# Altium schematic sheet greento_schematic.SchDoc
size A; SheetNumber: 1; SheetTotal: 1
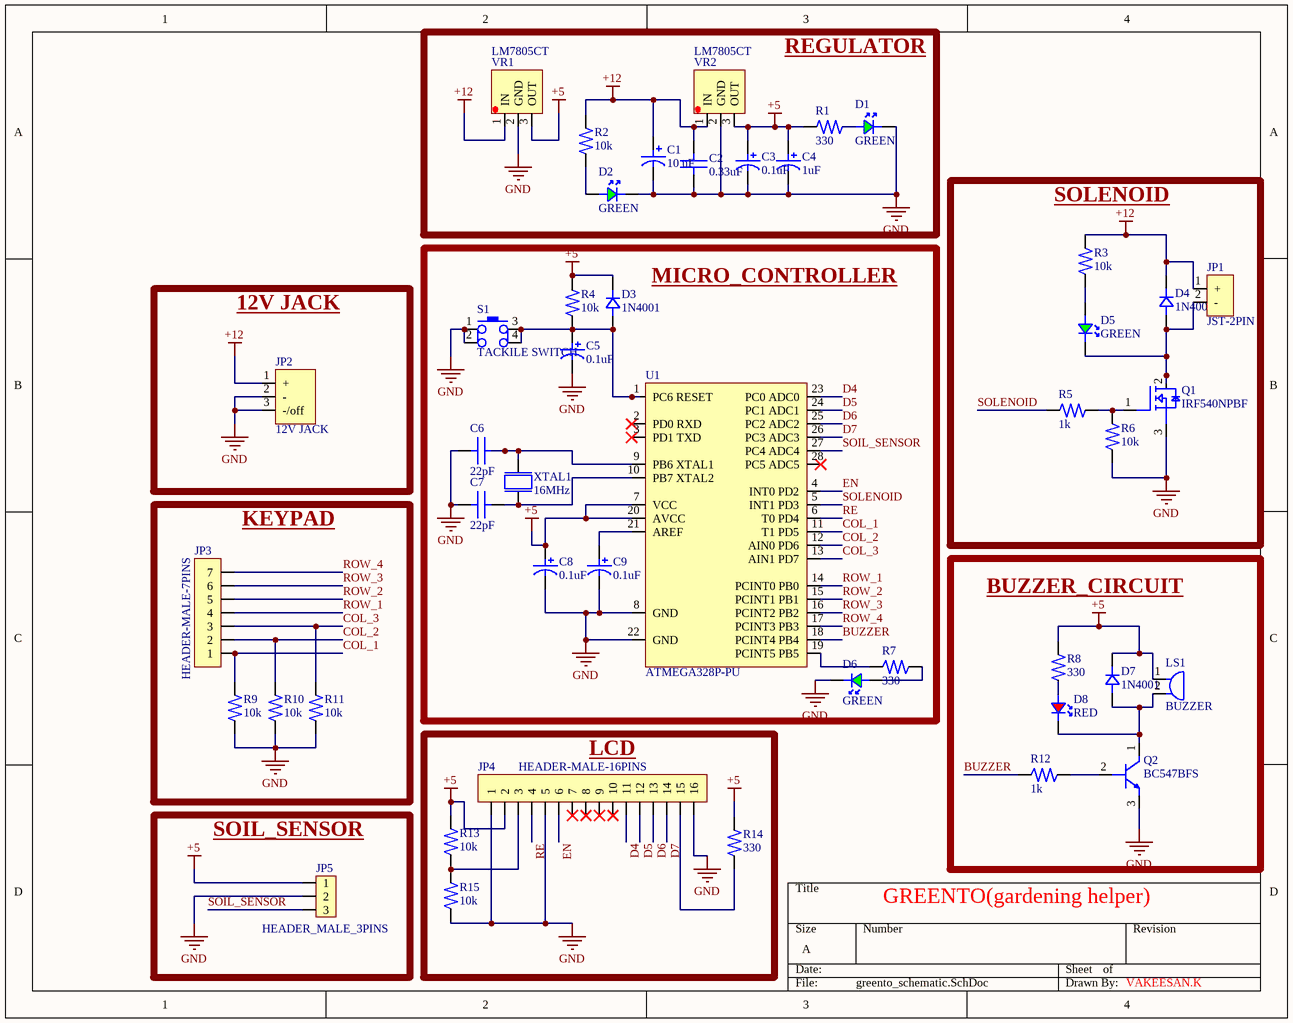
[diagram p0: greento_schematic.SchDoc]

## Parts
C1  Supplier Part Number 1: 10 uF  [CAP ALUM 10UF 20% 450V RADIAL]  (hidden comment: CAP ALUM 10UF 20% 450V RADIAL)
C2  Supplier Part Number 1: 0.33uF  [CAP CER 0.33UF 50V X7R RADIAL]  (hidden comment: CAP CER 0.33UF 50V X7R RADIAL)
C3  Supplier Part Number 1: 0.1uF  [CAP ALUM 0.1UF 20% 50V RADIAL]  (hidden comment: CAP ALUM 0.1UF 20% 50V RADIAL)
C4  Supplier Part Number 1: 1uF  [CAP ALUM 1UF 20% 100V RADIAL]  (hidden comment: CAP ALUM 1UF 20% 100V RADIAL)
C5  Supplier Part Number 1: 0.1uF  [CAP ALUM 0.1UF 20% 50V RADIAL]  (hidden comment: CAP ALUM 0.1UF 20% 50V RADIAL)
C6  Supplier Part Number 1: 22pF  [CAP CER 22PF 200V NP0 RADIAL]  (hidden comment: CAP CER 22PF 200V NP0 RADIAL)
C7  Supplier Part Number 1: 22pF  [CAP CER 22PF 200V NP0 RADIAL]  (hidden comment: CAP CER 22PF 200V NP0 RADIAL)
C8  Supplier Part Number 1: 0.1uF  [CAP ALUM 0.1UF 20% 50V RADIAL]  (hidden comment: CAP ALUM 0.1UF 20% 50V RADIAL)
C9  Supplier Part Number 1: 0.1uF  [CAP ALUM 0.1UF 20% 50V RADIAL]  (hidden comment: CAP ALUM 0.1UF 20% 50V RADIAL)
D1  Supplier Part Number 1: GREEN  [LED GREEN CLEAR T-1 3/4 T/H]  (hidden comment: LED GREEN CLEAR T-1 3/4 T/H)
D2  Supplier Part Number 1: GREEN  [LED GREEN CLEAR T-1 3/4 T/H]  (hidden comment: LED GREEN CLEAR T-1 3/4 T/H)
D3  Supplier Part Number 1: 1N4001  [Diode 1N001]  (hidden comment: DIODE GEN PURP 50V 1A DO41)
D4  Supplier Part Number 1: 1N4001  [Diode 1N001]  (hidden comment: DIODE GEN PURP 50V 1A DO41)
D5  Supplier Part Number 1: GREEN  [LED GREEN CLEAR T-1 3/4 T/H]  (hidden comment: LED GREEN CLEAR T-1 3/4 T/H)
D6  Supplier Part Number 1: GREEN  [LED GREEN CLEAR T-1 3/4 T/H]  (hidden comment: LED GREEN CLEAR T-1 3/4 T/H)
D7  Supplier Part Number 1: 1N4001  [Diode 1N001]  (hidden comment: DIODE GEN PURP 50V 1A DO41)
D8  Supplier Part Number 1: RED  [RED GREEN CLEAR T-1 3/4 T/H]  (hidden comment: LED RED DIFFUSED T-1 3/4 T/H)
JP1  Supplier Part Number 1: JST-2PIN  [CONN HEADER VERT 2POS 2.5MM]  (hidden comment: CONN HEADER VERT 2POS 2.5MM)
JP2  Supplier Part Number 1: 12V JACK  [CONN PWR JACK 2X5.5MM SOLDER]  (hidden comment: PJ-002A)
JP3  Supplier Part Number 1: HEADER-MALE-7PINS  [HEADER MALE 7 PIN]  (hidden comment: CONN HEADER VERT 07POS 2.54MM)
JP4  Supplier Part Number 1: HEADER-MALE-16PINS  [header male 16 pin]  (hidden comment: CONN HEADER VERT 16POS 2.54MM)
JP5  Supplier Part Number 1: HEADER_MALE_3PINS  [HEADER MALE 3 PIN]  (hidden comment: CONN HEADER VERT 03POS 2.54MM)
LS1  Supplier Part Number 1: BUZZER  [BUZZER PIEZO 5V 13.9MM TH]  (hidden comment: BUZZER PIEZO 5V 13.9MM TH)
Q1  MOSFET N-CH 100V 33A TO220AB  [IRF540NPBF]  (value not drawn)
Q2  Supplier Part Number 1: BC547BFS  [BC547B]  (hidden comment: TRANS NPN 45V 0.1A TO92-3)
R1  Supplier Part Number 1: 330  [RES 330 OHM 5% 1/2W AXIAL]  (hidden comment: RES 330 OHM 5% 1/2W AXIAL)
R2  Supplier Part Number 1: 10k  [RES 10K OHM 5% 1/4W AXIAL]  (hidden comment: RES 10K OHM 5% 1/4W AXIAL)
R3  Supplier Part Number 1: 10k  [RES 10K OHM 5% 1/4W AXIAL]  (hidden comment: RES 10K OHM 5% 1/4W AXIAL)
R4  Supplier Part Number 1: 10k  [RES 10K OHM 5% 1/4W AXIAL]  (hidden comment: RES 10K OHM 5% 1/4W AXIAL)
R5  Supplier Part Number 1: 1k  [RES 1K OHM 5% 1/4W AXIAL]  (hidden comment: RES 1K OHM 5% 1/4W AXIAL)
R6  Supplier Part Number 1: 10k  [RES 10K OHM 5% 1/4W AXIAL]  (hidden comment: RES 10K OHM 5% 1/4W AXIAL)
R7  Supplier Part Number 1: 330  [RES 330 OHM 5% 1/2W AXIAL]  (hidden comment: RES 330 OHM 5% 1/2W AXIAL)
R8  Supplier Part Number 1: 330  [RES 330 OHM 5% 1/2W AXIAL]  (hidden comment: RES 330 OHM 5% 1/2W AXIAL)
R9  Supplier Part Number 1: 10k  [RES 10K OHM 5% 1/4W AXIAL]  (hidden comment: RES 10K OHM 5% 1/4W AXIAL)
R10  Supplier Part Number 1: 10k  [RES 10K OHM 5% 1/4W AXIAL]  (hidden comment: RES 10K OHM 5% 1/4W AXIAL)
R11  Supplier Part Number 1: 10k  [RES 10K OHM 5% 1/4W AXIAL]  (hidden comment: RES 10K OHM 5% 1/4W AXIAL)
R12  Supplier Part Number 1: 1k  [RES 1K OHM 5% 1/4W AXIAL]  (hidden comment: RES 1K OHM 5% 1/4W AXIAL)
R13  Supplier Part Number 1: 10k  [RES 10K OHM 5% 1/4W AXIAL]  (hidden comment: RES 10K OHM 5% 1/4W AXIAL)
R14  Supplier Part Number 1: 330  [RES 330 OHM 5% 1/2W AXIAL]  (hidden comment: RES 330 OHM 5% 1/2W AXIAL)
R15  Supplier Part Number 1: 10k  [RES 10K OHM 5% 1/4W AXIAL]  (hidden comment: RES 10K OHM 5% 1/4W AXIAL)
S1  Supplier Part Number 1: TACKILE SWITCH  [Tacktile switch]  (hidden comment: SWITCH TACTILE SPST-NO 0.05A 12V)
U1  AVR series Microcontroller IC 8-Bit 20MHz 32KB (16K x 16) FLASH 28-PDIP  [ATMEGA328P]  (value not drawn)
VR1  LM7805CT  [lm7805]
VR2  LM7805CT  [lm7805]
XTAL1  Supplier Part Number 1: 16MHz  [CRYSTAL 16.0000MHZ 20PF TH]  (hidden comment: CRYSTAL 16.0000MHZ 20PF TH)

## Blocks framed on the sheet
REGULATOR: C1-C4 D1 D2 R1 R2 VR1 VR2
SOLENOID: D4 D5 JP1 Q1 R3 R5 R6
12V JACK: JP2
MICRO_CONTROLLER: C5-C9 D3 D6 R4 R7 S1 U1 XTAL1
KEYPAD: JP3 R9-R11
BUZZER_CIRCUIT: D7 D8 LS1 Q2 R8 R12
LCD: JP4 R13-R15
SOIL_SENSOR: JP5

## Nets
+5: C3.1(+) C4.1(+) C8.1(+) D3.K(-) D7.K(-) JP4.2 JP5.VCC(1) LS1.1(+) R1.1 R4.2 R8.1 R13.2 R14.2 U1.7(VCC) U1.20(AVCC) VR1.3(OUT) VR2.3(OUT)
+12: C1.1(+) C2.2 D4.K(-) JP1.1(+) JP2.1(+) R2.2 R3.1 VR1.1(IN) VR2.1(IN)
GND: C1.2(-) C2.1 C3.2(-) C4.2(-) C5.2(-) C6.2 C7.2 C8.2(-) C9.2(-) D1.K(-) D2.K(-) D6.K(-) JP2.2(-) JP2.3(-/off) JP4.1 JP4.5 JP4.16 JP5.GND(2) Q1.3(S) Q2.3(EMITTER) R6.1 R9.1 R10.1 R11.1 R15.1 S1.1 S1.2 U1.8(GND) U1.22(GND) VR1.2(GND) VR2.2(GND)
BUZZER: R12.1 U1.18(PCINT4_PB4)
COL_1: JP3.1 R9.2 U1.11(T1_PD5)
COL_2: JP3.2 R10.2 U1.12(AIN0_PD6)
COL_3: JP3.3 R11.2 U1.13(AIN1_PD7)
D4: JP4.11 U1.23(PC0_ADC0)
D5: JP4.12 U1.24(PC1_ADC1)
D6: JP4.13 U1.25(PC2_ADC2)
D7: JP4.14 U1.26(PC3_ADC3)
EN: JP4.6 U1.4(INT0_PD2)
RE: JP4.4 U1.6(T0_PD4)
ROW_1: JP3.4 U1.14(PCINT0_PB0)
ROW_2: JP3.5 U1.15(PCINT1_PB1)
ROW_3: JP3.6 U1.16(PCINT2_PB2)
ROW_4: JP3.7 U1.17(PCINT3_PB3)
SOIL_SENSOR: JP5.AIN(3) U1.27(PC4_ADC4)
SOLENOID: R5.1 U1.5(INT1_PD3)
NetC5_1: C5.1(+) D3.A(+) R4.1 S1.3 S1.4 U1.1(PC6_RESET)
NetC6_1: C6.1 U1.9(PB6_XTAL1) XTAL1.2(PIN2)
NetC7_1: C7.1 U1.10(PB7_XTAL2) XTAL1.1(PIN1)
NetC9_1: C9.1(+) U1.21(AREF)
NetD1_A: D1.A(+) R1.2
NetD2_A: D2.A(+) R2.1
NetD4_A: D4.A(+) D5.K(-) JP1.2(-) Q1.2(D)
NetD5_A: D5.A(+) R3.2
NetD6_A: D6.A(+) R7.2
NetD7_A: D7.A(+) D8.K(-) LS1.2(-) Q2.1(COLLECTOR)
NetD8_A: D8.A(+) R8.2
NetJP4_3: JP4.3 R13.1 R15.2
NetJP4_15: JP4.15 R14.1
NetQ1_1: Q1.1(G) R5.2 R6.2
NetQ2_2: Q2.2(BASE) R12.2
NetR7_1: R7.1 U1.19(PCINT5_PB5)

Not connected (* = marked no-connect by the designer): JP4 7* 8* 9* 10*; U1 2(PD0_RXD)* 3(PD1_TXD)* 28(PC5_ADC5)*

## Notes on the sheet
- GREENTO(gardening helper)
- VAKEESAN.K

## Library data of the parts
C1 = 450BXC10MEFC10X20: BXC Series 450 V 10 µF 10x20mm Aluminum Electrolytic Capacitor; Manufacturer: Rubycon; Dielectric Material: Aluminium; Ripple Current: 99mA; Life (Hours): 10000Hour; Supplier 1: Digi-Key; Manufacturer Part Number: 450BXC10MEFC10X20; RoHS: Yes; Category: Aluminum Electrolytic Capacitors; Stock 1: 68178; Pricing 1: 1=0.77000, 10=0.54700, 50=0.41380, 100=0.36030, 500=0.26692, 1000=0.22688, 2500=0.21353, 5000=0.20019 (USD); Mount: Through Hole; Case/Package: Radial; Min Operating Temperature: -25°C; Max Operating Temperature: 105°C; Capacitance: 10uF; Tolerance: 20%; Termination: Radial; Package Quantity: 1000; Voltage Rating: 450V; Packaging: Bulk; Voltage Rating (DC): 450V; Voltage: 450V; Series: BXC; Diameter: 10mm; Height: 20mm; Lead Pitch: 5mm; Height - Seated (Max): 0.866inch; Radiation Hardening: No; REACH SVHC: Unknown; Lead Free: Lead Free; RoHS Compliant: Yes; ComponentLink1URL: https://datasheet.ciiva.com/11780/0900766b80f2a138-11780805.pdf?src-supplier=RSComponents; ComponentLink1Description: https://datasheet.ciiva.com/11780/0900766b80f2a138-11780805.pdf?src-supplier=RSComponents; ComponentLink2URL: https://datasheet.ciiva.com/1456/610966-1456385.pdf?src-supplier=Element14; ComponentLink2Description: https://datasheet.ciiva.com/1456/610966-1456385.pdf?src-supplier=Element14
C2 = FK24X7R1H334K: Cap Ceramic 0.33uF 50V X7R 10% Radial 5mm 125C Bulk; Manufacturer: TDK; Capacitance: 330nF; Lead/Base Style: Kinked; Lead Diameter: 0.5mm; Supplier 1: Digi-Key; Manufacturer Part Number: FK24X7R1H334K; RoHS: Yes; Category: Ceramic Capacitors; Stock 1: 6787; Pricing 1: 1=0.35000, 10=0.24500, 50=0.17140, 100=0.14680, 500=0.11014, 1000=0.09300, 2500=0.08811, 5000=0.08322 (USD); Mount: Through Hole; Case/Package: Radial; Min Operating Temperature: -55°C; Max Operating Temperature: 125°C; Voltage Rating (DC): 50V; Tolerance: 10%; Packaging: Bulk; Package Quantity: 500; Voltage Rating: 50V; Dielectric: X7R; Termination: Radial; Series: FK; Length: 0.217inch; Width: 4.5mm; Height: 2.5mm; Lead Pitch: 5mm; Height - Seated (Max): 0.217inch; Radiation Hardening: No; RoHS Compliant: Yes; Lead Free: Lead Free; ComponentLink1URL: https://datasheet.ciiva.com/5388/tdk-lowvoltageleadmlcc-commercial-general-en-347111-5388967.pdf?src-supplier=Mouser; ComponentLink1Description: https://datasheet.ciiva.com/5388/tdk-lowvoltageleadmlcc-commercial-general-en-347111-5388967.pdf?src-supplier=Mouser; ComponentLink2URL: https://datasheet.ciiva.com/142/leadmlcc-commercial-general-en-142555.pdf?src-supplier=Digi-Key; ComponentLink2Description: https://datasheet.ciiva.com/142/leadmlcc-commercial-general-en-142555.pdf?src-supplier=Digi-Key; ComponentLink3URL: https://datasheet.ciiva.com/11590/e4941-fk-11590557.pdf?src-supplier=Avnet; ComponentLink3Description: https://datasheet.ciiva.com/11590/e4941-fk-11590557.pdf?src-supplier=Avnet
C3 C5 C8 C9 = UVZ1H0R1MDD1TD: NICHICON         UVZ1H0R1MDD1TD             ALUMINUM ELECTROLYTIC CAPACITOR, 0.1UF, 50V, 20%, RADIAL; Dielectric Material: Aluminium; Capacitance: 100nF; Ripple Current: 1.3mA; Life (Hours): 1000Hour; Lead/Base Style: Straight; Supplier 1: Digi-Key; Manufacturer: Nichicon; Manufacturer Part Number: UVZ1H0R1MDD1TD; RoHS: Yes; Category: Aluminum Electrolytic Capacitors; Stock 1: 9888; Pricing 1: 1=0.31000, 10=0.21400, 50=0.14260, 100=0.12120, 500=0.08556, 1000=0.07486 (USD); Mount: Through Hole; Case/Package: Radial; Number of Pins: 2; Min Operating Temperature: -55°C; Max Operating Temperature: 105°C; Package Quantity: 2000; Packaging: Tape and Reel; Tolerance: 20%; Voltage Rating: 50V; Termination: Radial; Voltage Rating (DC): 50V; Series: VZ; Diameter: 5mm; Height: 11mm; Lead Pitch: 0.079inch; Height - Seated (Max): 0.492inch; REACH SVHC: No SVHC; RoHS Compliant: Yes; ComponentLink1URL: https://datasheet.ciiva.com/7336/e-vz-7336149.pdf?src-supplier=Newark; ComponentLink1Description: https://datasheet.ciiva.com/7336/e-vz-7336149.pdf?src-supplier=Newark; ComponentLink2URL: https://datasheet.ciiva.com/29550/e-vz-29550229.pdf?src-supplier=Digi-Key; ComponentLink2Description: https://datasheet.ciiva.com/29550/e-vz-29550229.pdf?src-supplier=Digi-Key; ComponentLink3URL: https://datasheet.ciiva.com/22749/1909357-22749707.pdf?src-supplier=Element14; ComponentLink3Description: https://datasheet.ciiva.com/22749/1909357-22749707.pdf?src-supplier=Element14; ComponentLink4URL: https://datasheet.ciiva.com/7781/e-vz-7781773.pdf?src-supplier=Element14; ComponentLink4Description: https://datasheet.ciiva.com/7781/e-vz-7781773.pdf?src-supplier=Element14
C4 = UVR2A010MDD1TD: Cap Aluminum 1uF 100V 20% (5 X 11mm) Radial 2.5mm 21mA 2000 hr 85°C Ammo Pack; Manufacturer: Nichicon; Dielectric Material: Aluminium; Leakage Current: 4uA; Life (Hours): 2000Hour; Dissipation Factor: 0.08%; Lead Diameter: 0.5mm; Supplier 1: Digi-Key; Manufacturer Part Number: UVR2A010MDD1TD; RoHS: Yes; Category: Aluminum Electrolytic Capacitors; Stock 1: 11511; Pricing 1: 1=0.30000, 10=0.20600, 50=0.13700, 100=0.11650, 500=0.08224, 1000=0.07197 (USD); Mount: Through Hole,PCB; Case/Package: Radial; Number of Pins: 2; Min Operating Temperature: -40°C; Max Operating Temperature: 85°C; Capacitance: 1uF; Tolerance: 20%; Voltage Rating: 100V; Ripple Current: 21mA; Package Quantity: 2000; Packaging: Tape and Reel; Voltage Rating (DC): 100V; Termination: Radial; Voltage: 100V; Series: VR; Construction: RADIAL; Diameter: 5mm; Length: 11mm; Height: 11mm; Lead Pitch: 2mm; Height - Seated (Max): 0.492inch; Radiation Hardening: No; REACH SVHC: No SVHC; Lead Free: Lead Free; RoHS Compliant: Yes; ComponentLink1URL: https://datasheet.ciiva.com/11688/e-vr-11688357.pdf?src-supplier=Avnet; ComponentLink1Description: https://datasheet.ciiva.com/11688/e-vr-11688357.pdf?src-supplier=Avnet; ComponentLink2URL: https://datasheet.ciiva.com/29550/e-vr-29550405.pdf?src-supplier=Digi-Key; ComponentLink2Description: https://datasheet.ciiva.com/29550/e-vr-29550405.pdf?src-supplier=Digi-Key; ComponentLink3URL: https://datasheet.ciiva.com/7907/e-vr-7907511.pdf?src-supplier=Element14; ComponentLink3Description: https://datasheet.ciiva.com/7907/e-vr-7907511.pdf?src-supplier=Element14; ComponentLink4URL: https://datasheet.ciiva.com/5330/e-vr-6088-5330601.pdf?src-supplier=Mouser; ComponentLink4Description: https://datasheet.ciiva.com/5330/e-vr-6088-5330601.pdf?src-supplier=Mouser; ComponentLink5URL: https://datasheet.ciiva.com/16392/e-vr-16392922.pdf?src-supplier=Future+Electronics; ComponentLink5Description: https://datasheet.ciiva.com/16392/e-vr-16392922.pdf?src-supplier=Future+Electronics; ComponentLink6URL: https://datasheet.ciiva.com/14599/70187464-14599886.pdf?src-supplier=Allied+Electronics; ComponentLink6Description: https://datasheet.ciiva.com/14599/70187464-14599886.pdf?src-supplier=Allied+Electronics
C6 C7 = C317C220J2G5TA: Cap Ceramic 22pF 200V C0G 5% Radial 5.08mm 125°C Extreme Low ESR Bulk; Manufacturer: KEMET; Dissipation Factor: 0.1%; Temperature Coefficient: 30ppm/°C; Lead/Base Style: Formed Leads; Lead Diameter: 0.51mm; Lead Length: 7mm; Supplier 1: Digi-Key; Manufacturer Part Number: C317C220J2G5TA; RoHS: Yes; Category: Ceramic Capacitors; Stock 1: 33492; Pricing 1: 1=0.20000, 10=0.13900, 50=0.08320, 100=0.07020, 500=0.04804, 1000=0.04250, 2500=0.04066, 5000=0.03696 (USD); Mount: Through Hole,PCB; Case/Package: Radial; Number of Pins: 2; Dielectric Material: Ceramic; Min Operating Temperature: -55°C; Max Operating Temperature: 125°C; Capacitance: 22pF; Tolerance: 5%; Dielectric: C0G; Packaging: Bulk; Termination: Radial; Voltage Rating: 200V; Package Quantity: 500; Voltage: 200V; Voltage Rating (DC): 200V; Series: Golden Max™; Construction: RADIAL; Length: 3.81mm; Width: 3.81mm; Height: 2.54mm; Lead Pitch: 5.08mm; Depth: 2.54mm; Height - Seated (Max): 0.23inch; Radiation Hardening: No; RoHS Compliant: Yes; REACH SVHC: No SVHC; Lead Free: Lead Free; ComponentLink1URL: https://datasheet.ciiva.com/14588/70095037-14588379.pdf?src-supplier=Allied+Electronics; ComponentLink1Description: https://datasheet.ciiva.com/14588/70095037-14588379.pdf?src-supplier=Allied+Electronics; ComponentLink2URL: https://datasheet.ciiva.com/6178/f3101-goldmax-6178014.pdf?src-supplier=Farnell; ComponentLink2Description: https://datasheet.ciiva.com/6178/f3101-goldmax-6178014.pdf?src-supplier=Farnell
D1 D2 D5 D6 = LTL-307GE: Green 5 mm T-13/4 40° Diffused 29 mcd 2.1 V LED Through Hole; Manufacturer: Vishay Lite-On; Luminous Intensity: 60mcd; Forward Current: 30mA; Forward Voltage: 2.1V; Lens Style: Dome,Diffused,Colored,Circular; Test Current: 10mA; Dominant Wavelength: 569nm; Number of Elements: 1; Power Dissipation: 100mW; Reverse Voltage: 5V; Wavelength: 565nm; Supplier 1: Digi-Key; Manufacturer Part Number: LTL-307GE; RoHS: Yes; Category: LEDs; Stock 1: 33535; Pricing 1: 1=0.36000, 10=0.19300, 100=0.08970, 500=0.08280, 1000=0.06486, 2000=0.06348, 5000=0.05520, 10000=0.04968, 25000=0.04416 (USD); Mount: Through Hole; Case/Package: Radial; Number of Pins: 2; Color: Green; Lens Color: Green; Min Operating Temperature: -55°C; Max Operating Temperature: 100°C; Viewing Angle: 40°; Packaging: Bulk; Number of LEDs: 1; Package Quantity: 1000; Illumination Color: Green; Lens Transparency: Clear; Series: -; Diameter: 5mm; Length: 5.85mm; Height: 8.6mm; Depth: 5.85mm; Radiation Hardening: No; RoHS Compliant: Yes; Lead Free: Lead Free; ComponentLink1URL: https://datasheet.ciiva.com/2112/ltl-307ge-2112299.pdf?src-supplier=Digi-Key; ComponentLink1Description: https://datasheet.ciiva.com/2112/ltl-307ge-2112299.pdf?src-supplier=Digi-Key; ComponentLink2URL: https://datasheet.ciiva.com/4692/100-307ge-41558-4692669.pdf?src-supplier=Mouser; ComponentLink2Description: https://datasheet.ciiva.com/4692/100-307ge-41558-4692669.pdf?src-supplier=Mouser; ComponentLink3URL: https://datasheet.ciiva.com/16216/ltl-307ge-16216217.pdf?src-supplier=Future+Electronics; ComponentLink3Description: https://datasheet.ciiva.com/16216/ltl-307ge-16216217.pdf?src-supplier=Future+Electronics; ComponentLink4URL: https://datasheet.ciiva.com/15118/getdatasheetpartid-214534-15118092.pdf?src-supplier=Verical; ComponentLink4Description: https://datasheet.ciiva.com/15118/getdatasheetpartid-214534-15118092.pdf?src-supplier=Verical; ComponentLink5URL: https://datasheet.ciiva.com/19482/790217-19482316.pdf?src-supplier=Jameco; ComponentLink5Description: https://datasheet.ciiva.com/19482/790217-19482316.pdf?src-supplier=Jameco
D3 D4 D7 = 1N4001G: Diode Switching 50V 1A 2-Pin DO-41 Bag; Manufacturer: ON Semiconductor; Element Configuration: Single; Max Surge Current: 30A; Forward Voltage: 1.1V; Max Reverse Current: 10uA; Polarity: Standard; Supplier 1: Digi-Key; Manufacturer Part Number: 1N4001G; RoHS: Yes; Category: Rectifier Diodes; Pricing 1: 1=0.32000, 10=0.26400, 100=0.14020, 500=0.09222, 1000=0.06271, 2000=0.05656, 5000=0.04918, 10000=0.04181, 50000=0.04060 (USD); Case/Package: DO-41; Number of Pins: 2; Contact Plating: Tin,Matte; Weight: 0.01lb; Min Operating Temperature: -65°C; Max Operating Temperature: 175°C; Packaging: Bulk; Package Quantity: 1000; Average Rectified Current: 1A; Peak Non-Repetitive Surge Current: 30A; Max Reverse Voltage (DC): 50V; Max Repetitive Reverse Voltage (Vrrm): 50V; Reverse Voltage: 50V; Series: -; Voltage Rating (DC): 50V; Current Rating: 1A; Output Current: 1A; Forward Current: 1A; Max Forward Surge Current (Ifsm): 30A; Diameter: 2.7mm; Length: 0.204inch; Width: 0.25inch; Height: 5.2mm; Radiation Hardening: No; RoHS Compliant: Yes; Lead Free: Lead Free; REACH SVHC: No SVHC; Halogen Free: Halogen Free; ComponentLink1URL: https://datasheet.ciiva.com/30479/0900766b811a6370-30479403.pdf?src-supplier=RSComponents; ComponentLink1Description: https://datasheet.ciiva.com/30479/0900766b811a6370-30479403.pdf?src-supplier=RSComponents; ComponentLink2URL: https://datasheet.ciiva.com/3304/1n4001-d-3304181.pdf?src-supplier=Avnet; ComponentLink2Description: https://datasheet.ciiva.com/3304/1n4001-d-3304181.pdf?src-supplier=Avnet; ComponentLink3URL: https://datasheet.ciiva.com/916/1n4001-d-916308.pdf?src-supplier=Digi-Key; ComponentLink3Description: https://datasheet.ciiva.com/916/1n4001-d-916308.pdf?src-supplier=Digi-Key
D8 = LTL-307P: Red 5 mm 50° Tinted Diffused 5.6 mcd 2.1 V LED Through Hole; Manufacturer: Vishay Lite-On; Luminous Intensity: 5.6mcd; Lens Style: Dome,Diffused,Colored,Circular,Tinted; Forward Current: 15mA; Forward Voltage: 2.1V; Test Current: 10mA; Dominant Wavelength: 657nm; Number of Elements: 1; Power Dissipation: 40mW; Reverse Voltage: 5V; Supplier 1: Digi-Key; Manufacturer Part Number: LTL-307P; RoHS: Yes; Category: LEDs; Stock 1: 11954; Pricing 1: 1=0.36000, 10=0.19300, 100=0.08970, 500=0.08280, 1000=0.06486, 2000=0.06348, 5000=0.05520, 10000=0.04968, 25000=0.04416 (USD); Mount: Through Hole; Case/Package: Radial; Number of Pins: 2; Color: Red; Lens Color: Red; Min Operating Temperature: -55°C; Max Operating Temperature: 100°C; Package Quantity: 1000; Viewing Angle: 50°; Packaging: Bulk; Illumination Color: Red; Lens Transparency: Diffused; Series: -; Wavelength: 657nm; Number of LEDs: 1; Max Power Dissipation: 40mW; Operating Wavelength-Nom: 657nm; Diameter: 5mm; Length: 5.85mm; Width: 5.85mm; Height: 8.6mm; Depth: 5.85mm; Radiation Hardening: No; Lead Free: Lead Free; RoHS Compliant: Yes; ComponentLink1URL: https://datasheet.ciiva.com/2112/ltl-307p-2112293.pdf?src-supplier=Digi-Key; ComponentLink1Description: https://datasheet.ciiva.com/2112/ltl-307p-2112293.pdf?src-supplier=Digi-Key; ComponentLink2URL: https://datasheet.ciiva.com/4692/100-307p-13516-4692492.pdf?src-supplier=Mouser; ComponentLink2Description: https://datasheet.ciiva.com/4692/100-307p-13516-4692492.pdf?src-supplier=Mouser; ComponentLink3URL: https://datasheet.ciiva.com/15117/getdatasheetpartid-187741-15117983.pdf?src-supplier=Verical; ComponentLink3Description: https://datasheet.ciiva.com/15117/getdatasheetpartid-187741-15117983.pdf?src-supplier=Verical; ComponentLink4URL: https://datasheet.ciiva.com/16331/lite-onltl-307p-16331293.pdf?src-supplier=Future+Electronics; ComponentLink4Description: https://datasheet.ciiva.com/16331/lite-onltl-307p-16331293.pdf?src-supplier=Future+Electronics
JP1 = B2B-XH-A(LF)(SN): Conn Shrouded Header (4 Sides) HDR 2 POS 2.5mm Solder ST Thru-Hole Box; Manufacturer: JST; Supplier 1: Digi-Key; Manufacturer Part Number: B2B-XH-A(LF)(SN); RoHS: Yes; Category: Headers and Wire Housings; Pricing 1: 1=0.15000, 10=0.11800, 100=0.08680, 500=0.07182, 1000=0.06284, 5000=0.05386, 10000=0.05237 (USD); ComponentLink1URL: https://datasheet.ciiva.com/11746/0900766b8082653e-11746979.pdf?src-supplier=RSComponents; ComponentLink1Description: https://datasheet.ciiva.com/11746/0900766b8082653e-11746979.pdf?src-supplier=RSComponents; ComponentLink2URL: https://datasheet.ciiva.com/26894/getdatasheetpartid-640357-26894434.pdf?src-supplier=Verical; ComponentLink2Description: https://datasheet.ciiva.com/26894/getdatasheetpartid-640357-26894434.pdf?src-supplier=Verical; ComponentLink3URL: https://datasheet.ciiva.com/26894/getdatasheetpartid-385291-26894760.pdf?src-supplier=Verical; ComponentLink3Description: https://datasheet.ciiva.com/26894/getdatasheetpartid-385291-26894760.pdf?src-supplier=Verical; ComponentLink4URL: https://datasheet.ciiva.com/8052/5448-8052024.pdf?src-supplier=Element14; ComponentLink4Description: https://datasheet.ciiva.com/8052/5448-8052024.pdf?src-supplier=Element14
JP2 = PJ-002A: 2.0 x 6.5 mm, 2.5 A, Horizontal, Through Hole, Dc Power Jack Connector; Manufacturer: CUI; Gender: Male; Shielding: Unshielded; Current Rating: 2.5A; Number of Conductors: 2; Voltage Rating: 24V; Insulation Resistance: 50MR; Supplier 1: Digi-Key; Manufacturer Part Number: PJ-002A; RoHS: Yes; Category: Connectors; Mount: Through Hole; Color: Black; Contact Material: Copper Alloy,Copper; Contact Plating: Tin,Nickel; Housing Material: Thermoplastic; Housing Color: Black; Min Operating Temperature: -25°C; Max Operating Temperature: 85°C; Connector Type: Jack; Termination: Through Hole; Packaging: Bulk; Package Quantity: 500; Orientation: Horizontal; Contact Gender: Male; Series: -; Diameter: 2.1mm; Lead Free: Lead Free; RoHS Compliant: Yes; Flammability Rating: UL94 V-0; ComponentLink1URL: http://www.mouser.com/ds/2/670/pj-002a-515880.pdf?src-supplier=Mouser; ComponentLink1Description: http://www.mouser.com/ds/2/670/pj-002a-515880.pdf?src-supplier=Mouser; ComponentLink2URL: http://www.cui.com/Product/Resource/FuturePDF/PJ-002A.pdf?src-supplier=Future+Electronics; ComponentLink2Description: http://www.cui.com/Product/Resource/FuturePDF/PJ-002A.pdf?src-supplier=Future+Electronics; ComponentLink3URL: https://www.cui.com/product/resource/digikeypdf/pj-002a.pdf?src-supplier=Digi-Key; ComponentLink3Description: https://www.cui.com/product/resource/digikeypdf/pj-002a.pdf?src-supplier=Digi-Key
JP3 = PRPC007SACN-RC: 07 Position Through-Hole Single Row Straight .100 Header; Manufacturer: Sullins; Manufacturer Part Number: PRPC040SACN-RC; Number of Positions: 40; Connector Type: Male Pin; Pitch: 0.1inch; Supplier 1: Digi-Key; RoHS: Yes; Category: Connectors; Stock 1: 10402; Pricing 1: 1=0.90000, 10=0.80100, 100=0.65960, 500=0.52140, 1000=0.45370 (USD); Mount: Through Hole; Color: Black; Contact Plating: Gold; Package Quantity: 1; Number of Rows: 1; Packaging: Bulk; Termination: Solder; Contact Type: Male Pin; Contact Mating Length: 0.23inch; Lead Free: Lead Free; RoHS Compliant: Yes; ComponentLink1URL: https://datasheet.ciiva.com/741/xrxczzzsxxn-rc-st-11635-b-741925.pdf?src-supplier=Digi-Key; ComponentLink1Description: https://datasheet.ciiva.com/741/xrxczzzsxxn-rc-st-11635-b-741925.pdf?src-supplier=Digi-Key
JP4 = PRPC016SACN-RC: 16 Position Through-Hole Single Row Straight .100 Header; Manufacturer: Sullins; Manufacturer Part Number: PRPC040SACN-RC; Number of Positions: 40; Connector Type: Male Pin; Pitch: 0.1inch; Supplier 1: Digi-Key; RoHS: Yes; Category: Connectors; Stock 1: 10402; Pricing 1: 1=0.90000, 10=0.80100, 100=0.65960, 500=0.52140, 1000=0.45370 (USD); Mount: Through Hole; Color: Black; Contact Plating: Gold; Package Quantity: 1; Number of Rows: 1; Packaging: Bulk; Termination: Solder; Contact Type: Male Pin; Contact Mating Length: 0.23inch; Lead Free: Lead Free; RoHS Compliant: Yes; ComponentLink1URL: https://datasheet.ciiva.com/741/xrxczzzsxxn-rc-st-11635-b-741925.pdf?src-supplier=Digi-Key; ComponentLink1Description: https://datasheet.ciiva.com/741/xrxczzzsxxn-rc-st-11635-b-741925.pdf?src-supplier=Digi-Key
JP5 = PRPC040SACN-RC: 03 Position Through-Hole Single Row Straight .100 Header; Manufacturer: Sullins; Number of Positions: 40; Connector Type: Male Pin; Pitch: 0.1inch; Supplier 1: Digi-Key; Manufacturer Part Number: PRPC040SACN-RC; RoHS: Yes; Category: Connectors; Stock 1: 10402; Pricing 1: 1=0.90000, 10=0.80100, 100=0.65960, 500=0.52140, 1000=0.45370 (USD); Mount: Through Hole; Color: Black; Contact Plating: Gold; Package Quantity: 1; Number of Rows: 1; Packaging: Bulk; Termination: Solder; Contact Type: Male Pin; Contact Mating Length: 0.23inch; Lead Free: Lead Free; RoHS Compliant: Yes; ComponentLink1URL: https://datasheet.ciiva.com/741/xrxczzzsxxn-rc-st-11635-b-741925.pdf?src-supplier=Digi-Key; ComponentLink1Description: https://datasheet.ciiva.com/741/xrxczzzsxxn-rc-st-11635-b-741925.pdf?src-supplier=Digi-Key
LS1 = CPI-137-83T: 13.9 mm, 5 Vdc, 83 dB, Through Hole, Driving Circuit, Piezo Audio Indicator Buzzer; Manufacturer: CUI; Supplier 1: Digi-Key; Manufacturer Part Number: CPI-137-83T; RoHS: No
Q1 = IRF540NPBF: Mosfet, Power; N-ch; Vdss 100V; Rds(on) 44MILLIOHMS; Id 33A; TO-220AB; Pd 130W; -55DEG; Manufacturer: International Rectifier; Gate to Source Voltage (Vgs): 20V; Rise Time: 35ns; Input Capacitance: 1.96nF; Number of Elements: 1; Rds On Max: 44mR; Threshold Voltage: 4V; Recovery Time: 170ns; Turn-On Delay Time: 11ns; Turn-Off Delay Time: 39ns; Current Rating: 27A; Element Configuration: Single; Polarization: N; Supplier 1: Digi-Key; Manufacturer Part Number: IRF540NPBF; RoHS: Yes; Category: MOSFETs; Mount: Through Hole; Case/Package: TO-220AB; Number of Pins: 3; Min Operating Temperature: -55°C; Max Operating Temperature: 175°C; Continuous Drain Current (ID): 33A; Max Power Dissipation: 130W; Packaging: Rail/Tube; Drain to Source Voltage (Vdss): 100V; Power Dissipation: 130W; Package Quantity: 50; Nominal Vgs: 4V; Dual Supply Voltage: 100V; Drain to Source Breakdown Voltage: 100V; Drain to Source Resistance: 44mR; Fall Time: 35ns; Termination: Through Hole; Voltage Rating (DC): 100V; On-State Resistance: 44MR; Series: HEXFET®; Drain-source On Resistance-Max: 44MR; Length: 10.54mm; Width: 0.185inch; Height: 15.24mm; Lead Pitch: 2.54mm; Radiation Hardening: No; RoHS Compliant: Yes; REACH SVHC: No SVHC; Lead Free: Lead Free; ComponentLink1URL: https://datasheet.ciiva.com/7271/irf540n-7271923.pdf?src-supplier=Newark; ComponentLink1Description: https://datasheet.ciiva.com/7271/irf540n-7271923.pdf?src-supplier=Newark; Supplier Part Number 1: IRF540NPBF
Q2 = BC547B: Trans GP BJT NPN 45V 0.1A 500mW Automotive 3-Pin TO-92 Ammo; Manufacturer: ON Semiconductor / Fairchild; Current Rating: 100mA; Transition Frequency: 300MHz; Element Configuration: Single; Number of Elements: 1; hFE Min: 200; Collector Base Voltage (VCBO): 50V; Emitter Base Voltage (VEBO): 6V; Collector Emitter Saturation Voltage: 300mV; Gain Bandwidth Product: 100MHz; Voltage: 40V; Supplier 1: Digi-Key; Manufacturer Part Number: BC547B; RoHS: Yes; Category: BJTs; Stock 1: 7180; Pricing 1: 1=0.50000, 10=0.36900, 100=0.20890, 500=0.13832, 1000=0.10605, 2000=0.09222, 5000=0.08300, 10000=0.07613 (USD); Mount: Through Hole; Case/Package: TO-92; Number of Pins: 3; Weight: 0.007055oz; Contact Plating: Copper,Tin,Silver; Min Operating Temperature: -65°C; Max Operating Temperature: 150°C; Packaging: Bulk; Polarity: NPN; Voltage Rating (DC): 45V; Max Power Dissipation: 500mW; Collector Emitter Voltage (VCEO): 45V; Max Collector Current: 100mA; Collector Emitter Breakdown Voltage: 45V; Package Quantity: 2000; Frequency: 300MHz; Power Dissipation: 500mW; Max Frequency: 300MHz; Max Breakdown Voltage: 45V; Length: 4.58mm; Width: 3.86mm; Height: 4.58mm; Radiation Hardening: No; Lead Free: Lead Free; REACH SVHC: No SVHC; ComponentLink1URL: https://datasheet.ciiva.com/17011/bc547-17011404.pdf?src-supplier=Future+Electronics; ComponentLink1Description: https://datasheet.ciiva.com/17011/bc547-17011404.pdf?src-supplier=Future+Electronics; ComponentLink2URL: https://datasheet.ciiva.com/985/bc546-547-548rev5-985523.pdf?src-supplier=Digi-Key; ComponentLink2Description: https://datasheet.ciiva.com/985/bc546-547-548rev5-985523.pdf?src-supplier=Digi-Key; ComponentLink3URL: https://datasheet.ciiva.com/972/bc546-972262.pdf?src-supplier=Digi-Key; ComponentLink3Description: https://datasheet.ciiva.com/972/bc546-972262.pdf?src-supplier=Digi-Key; ComponentLink4URL: https://datasheet.ciiva.com/1195/1868820-1195464.pdf?src-supplier=Element14; ComponentLink4Description: https://datasheet.ciiva.com/1195/1868820-1195464.pdf?src-supplier=Element14; ComponentLink5URL: https://datasheet.ciiva.com/11197/bc550-11197769.pdf?src-supplier=Avnet; ComponentLink5Description: https://datasheet.ciiva.com/11197/bc550-11197769.pdf?src-supplier=Avnet
R1 R7 R8 R14 = CFM12JT330R: Res Carbon Film 330 Ohm 5% 1/2W -400ppm/°C to 0ppm/°C Conformal AXL Thru-Hole T/R; Manufacturer: Stackpole Electronics; Resistance: 330R; Max Power Dissipation: 500mW; Supplier 1: Digi-Key; Manufacturer Part Number: CFM12JT330R; RoHS: Yes; Category: Through-Hole Resistors; Stock 1: 145485; Pricing 1: 1=0.10000, 10=0.06700, 25=0.04880, 50=0.03720, 100=0.02740, 250=0.02092, 500=0.01672, 1000=0.01231 (USD); Mount: Through Hole,Axial; Case/Package: Axial; Contact Plating: Tin,Matte; Min Operating Temperature: -55°C; Max Operating Temperature: 155°C; Packaging: Tape and Reel; Tolerance: 5%; Resistor Type: Carbon Film; Temperature Coefficient: -400ppm/°C; Number of Terminations: 2; Features: Flame Retardant Coating; Series: CFM; Diameter: 2.3mm; Length: 0.256inch; Radiation Hardening: No; RoHS Compliant: Yes; Lead Free: Lead Free; ComponentLink1URL: https://www.seielect.com/Catalog/SEI-CF_CFM.pdf?src-supplier=Digi-Key; ComponentLink1Description: https://www.seielect.com/Catalog/SEI-CF_CFM.pdf?src-supplier=Digi-Key; ComponentLink2URL: https://www.seielect.com/catalog/SEI-Packaging.pdf?src-supplier=Digi-Key; ComponentLink2Description: https://www.seielect.com/catalog/SEI-Packaging.pdf?src-supplier=Digi-Key; ComponentLink3URL: https://www.seielect.com/catalog/SEI-CF_CFM.pdf?src-supplier=Avnet; ComponentLink3Description: https://www.seielect.com/catalog/SEI-CF_CFM.pdf?src-supplier=Avnet
R2-R4 R6 R9-R11 R13 R15 = CF14JT10K0: Res Carbon Film 10K Ohm 5% 0.25W(1/4W) -500ppm/¦; Manufacturer: Stackpole Electronics; Resistance: 10kR; Power Rating: 250mW; Temperature Coefficient: -500ppm/°C; Supplier 1: Digi-Key; Manufacturer Part Number: CF14JT10K0; RoHS: Yes; Category: Through-Hole Resistors; Stock 1: 658665; Pricing 1: 1=0.10000, 10=0.05600, 25=0.04040, 50=0.03080, 100=0.02260, 250=0.01728, 500=0.01382, 1000=0.01017 (USD); Mount: Through Hole,Axial; Case/Package: Conformal; Contact Plating: Tin,Matte; Min Operating Temperature: -55°C; Max Operating Temperature: 155°C; Packaging: Tape and Reel; Tolerance: 5%; Package Quantity: 1; Resistor Type: Carbon Film; Number of Terminations: 2; Max Power Dissipation: 250mW; Features: Flame Retardant Coating; Series: CF; Termination: Axial; Construction: Cylindrical; Diameter: 2.3mm; Length: 6.5mm; Radiation Hardening: No; Lead Free: Lead Free; RoHS Compliant: Yes; Military Standard: Not; ComponentLink1URL: http://components.arrow.com/part/dataview/27619991S9848636N1174?src-supplier=Arrow+Electronics; ComponentLink1Description: http://components.arrow.com/part/dataview/27619991S9848636N1174?src-supplier=Arrow+Electronics; ComponentLink2URL: https://www.verical.com/server-webapp/html/getDatasheet?partID=367360&src-supplier=Verical; ComponentLink2Description: https://www.verical.com/server-webapp/html/getDatasheet?partID=367360&src-supplier=Verical; ComponentLink3URL: https://www.seielect.com/catalog/SEI-CF_CFM.pdf?src-supplier=Avnet; ComponentLink3Description: https://www.seielect.com/catalog/SEI-CF_CFM.pdf?src-supplier=Avnet; ComponentLink4URL: http://www.seielect.com/Catalog/SEI-CF_CFM.pdf?src-supplier=Future+Electronics; ComponentLink4Description: http://www.seielect.com/Catalog/SEI-CF_CFM.pdf?src-supplier=Future+Electronics; ComponentLink5URL: https://www.seielect.com/catalog/SEI-Packaging.pdf?src-supplier=Digi-Key; ComponentLink5Description: https://www.seielect.com/catalog/SEI-Packaging.pdf?src-supplier=Digi-Key
R5 R12 = CF14JT1K00: Res Carbon Film 1K Ohm 5% 1/4W -400ppm/°C to 0ppm/°C Conformal AXL Thru-Hole T/R; Manufacturer: Stackpole Electronics; Resistance: 1kR; Power Rating: 250mW; Supplier 1: Digi-Key; Manufacturer Part Number: CF14JT1K00; RoHS: Yes; Category: Through-Hole Resistors; Stock 1: 1034267; Pricing 1: 1=0.10000, 10=0.05600, 25=0.04040, 50=0.03080, 100=0.02260, 250=0.01728, 500=0.01382, 1000=0.01017 (USD); Mount: Through Hole,Axial; Case/Package: Conformal; Contact Plating: Tin,Matte; Min Operating Temperature: -55°C; Max Operating Temperature: 155°C; Tolerance: 5%; Packaging: Tape and Reel; Package Quantity: 1; Resistor Type: Carbon Film; Temperature Coefficient: -400ppm/°C; Number of Terminations: 2; Max Power Dissipation: 250mW; Features: Flame Retardant Coating; Series: CF; Termination: Axial; Construction: Cylindrical; Diameter: 2.3mm; Length: 6.5mm; Radiation Hardening: No; Lead Free: Lead Free; RoHS Compliant: Yes; Military Standard: Not; ComponentLink1URL: http://components.arrow.com/part/dataview/27620077S9848643N1174?src-supplier=Arrow+Electronics; ComponentLink1Description: http://components.arrow.com/part/dataview/27620077S9848643N1174?src-supplier=Arrow+Electronics; ComponentLink2URL: http://www.seielect.com/Catalog/SEI-CF_CFM.pdf?src-supplier=Future+Electronics; ComponentLink2Description: http://www.seielect.com/Catalog/SEI-CF_CFM.pdf?src-supplier=Future+Electronics; ComponentLink3URL: https://www.seielect.com/catalog/SEI-CF_CFM.pdf?src-supplier=Avnet; ComponentLink3Description: https://www.seielect.com/catalog/SEI-CF_CFM.pdf?src-supplier=Avnet; ComponentLink4URL: https://www.seielect.com/catalog/SEI-Packaging.pdf?src-supplier=Digi-Key; ComponentLink4Description: https://www.seielect.com/catalog/SEI-Packaging.pdf?src-supplier=Digi-Key; ComponentLink5URL: https://www.seielect.com/Catalog/SEI-CF_CFM.pdf?src-supplier=Digi-Key; ComponentLink5Description: https://www.seielect.com/Catalog/SEI-CF_CFM.pdf?src-supplier=Digi-Key; ComponentLink6URL: https://www.verical.com/server-webapp/html/getDatasheet?partID=360403&src-supplier=Verical; ComponentLink6Description: https://www.verical.com/server-webapp/html/getDatasheet?partID=360403&src-supplier=Verical
S1 = TL1105BF160Q: Switch Tactile N.O. SPST Round Button PC Pins 0.05A 50VDC 1.57N Thru-Hole; Manufacturer: E-Switch; Supplier 1: Digi-Key; Manufacturer Part Number: TL1105BF160Q; RoHS: Yes; Category: Tactile Switches; Stock 1: 1174; Pricing 1: 1=0.20000, 10=0.19300, 25=0.18320, 100=0.16660, 250=0.15664, 500=0.14332, 1000=0.11999, 2500=0.11666, 5000=0.10999 (USD); ComponentLink1URL: https://datasheet.ciiva.com/16156/p010003-16156249.pdf?src-supplier=Onlinecomponents.com; ComponentLink1Description: https://datasheet.ciiva.com/16156/p010003-16156249.pdf?src-supplier=Onlinecomponents.com; ComponentLink2URL: https://datasheet.ciiva.com/2900/p010003-2900804.pdf?src-supplier=Digi-Key; ComponentLink2Description: https://datasheet.ciiva.com/2900/p010003-2900804.pdf?src-supplier=Digi-Key; ComponentLink3URL: https://datasheet.ciiva.com/7637/tl1105-7637643.pdf?src-supplier=Element14; ComponentLink3Description: https://datasheet.ciiva.com/7637/tl1105-7637643.pdf?src-supplier=Element14
U1 = ATMEGA328P-PU: Manufacturer: Microchip / Atmel; RAM Size: 2KB; Number of PWM Channels: 6; Number of Timers/Counters: 3; Min Supply Voltage: 1.8V; Max Supply Voltage: 5.5V; Interface: I2C,SPI,UART,USART,2-Wire; Number of I/Os: 23; Oscillator Type: Internal; Data Bus Width: 8b; Number of SPI Channels: 1; Watchdog Timer: Yes; Peripherals: Brown-out Detect/Reset,POR,PWM,WDT; Supplier 1: Digi-Key; Manufacturer Part Number: ATMEGA328P-PU; RoHS: Yes; Category: Microcontrollers; Mount: Through Hole; Case/Package: PDIP; Number of Pins: 28; Contact Plating: Tin,Matte; Min Operating Temperature: -40°C; Max Operating Temperature: 85°C; Package Quantity: 14; Core Architecture: AVR; Series: AVR® ATmega; Number of ADC Channels: 6; Packaging: Rail/Tube; Frequency: 20MHz; Number of Programmable I/O: 23; Max Frequency: 20MHz; Number of I2C Channels: 1; Memory Type: FLASH; Memory Size: 32KB; Length: 37.4mm; Width: 6.76mm; Height: 3.28mm; Radiation Hardening: No; REACH SVHC: No SVHC; Lead Free: Lead Free; RoHS Compliant: Yes; ComponentLink1URL: https://datasheet.ciiva.com/1157/1684409-1157696.pdf?src-supplier=Element14; ComponentLink1Description: https://datasheet.ciiva.com/1157/1684409-1157696.pdf?src-supplier=Element14; ComponentLink2URL: https://datasheet.ciiva.com/19457/2139111-19457070.pdf?src-supplier=Jameco; ComponentLink2Description: https://datasheet.ciiva.com/19457/2139111-19457070.pdf?src-supplier=Jameco; ComponentLink3URL: https://datasheet.ciiva.com/29119/155197-da-01-en-microcontr-atmega328p-pu-8bit-pdip-28-29119593.pdf?src-supplier=Conrad; ComponentLink3Description: https://datasheet.ciiva.com/29119/155197-da-01-en-microcontr-atmega328p-pu-8bit-pdip-28-29119593.pdf?src-supplier=Conrad; ComponentLink4URL: https://datasheet.ciiva.com/15213/getdatasheetpartid-318533-15213133.pdf?src-supplier=Verical; ComponentLink4Description: https://datasheet.ciiva.com/15213/getdatasheetpartid-318533-15213133.pdf?src-supplier=Verical; Supplier Part Number 1: ATMEGA328P-PU
VR1 VR2 = LM7805CT: LM78XX Series 5 V Fixed Output 1 A 3-Terminal LDO Voltage Regulator - TO-220; Manufacturer: ON Semiconductor / Fairchild; Output Voltage: 5V; Number of Outputs: 1; Output Current: 1A; Dropout Voltage: 2V; Max Input Voltage: 35V; Min Input Voltage: 7V; Polarity: Positive; Quiescent Current: 8mA; Accuracy: 4%; Power Supply Rejection Ratio (PSRR): 73dB; Max Output Voltage: 5.2V; Supplier 1: Digi-Key; Manufacturer Part Number: LM7805CT; RoHS: Yes; Category: Voltage Regulators - Linear; Mount: Through Hole; Case/Package: TO-220-3; Number of Pins: 3; Weight: 1.214g; Min Operating Temperature: -40°C; Max Operating Temperature: 125°C; Packaging: Rail/Tube; Output Type: Fixed; Max Output Current: 1A; Number of Regulators: 1; Output Voltage Accuracy: 4%; Current Rating: 1A; Package Quantity: 50; Nominal Output Voltage: 5V; Min Output Voltage: 5V; Length: 10.67mm; Width: 4.7mm; Height: 16.3mm; Radiation Hardening: No; Lead Free: Lead Free; RoHS Compliant: Yes; REACH SVHC: No SVHC; ComponentLink1URL: https://datasheet.ciiva.com/19456/786138-19456361.pdf?src-supplier=Jameco; ComponentLink1Description: https://datasheet.ciiva.com/19456/786138-19456361.pdf?src-supplier=Jameco; ComponentLink2URL: https://datasheet.ciiva.com/1512/1855686-1512105.pdf?src-supplier=Element14; ComponentLink2Description: https://datasheet.ciiva.com/1512/1855686-1512105.pdf?src-supplier=Element14; ComponentLink3URL: https://datasheet.ciiva.com/1512/1855686-1512106.pdf?src-supplier=Element14; ComponentLink3Description: https://datasheet.ciiva.com/1512/1855686-1512106.pdf?src-supplier=Element14; ComponentLink4URL: https://datasheet.ciiva.com/1511/1855686-1511835.pdf?src-supplier=Element14; ComponentLink4Description: https://datasheet.ciiva.com/1511/1855686-1511835.pdf?src-supplier=Element14; ComponentLink5URL: https://datasheet.ciiva.com/8239/lm7812-8239478.pdf?src-supplier=Avnet; ComponentLink5Description: https://datasheet.ciiva.com/8239/lm7812-8239478.pdf?src-supplier=Avnet; ComponentLink6URL: https://datasheet.ciiva.com/17332/lm7805-17332792.pdf?src-supplier=Future+Electronics; ComponentLink6Description: https://datasheet.ciiva.com/17332/lm7805-17332792.pdf?src-supplier=Future+Electronics; ComponentLink7URL: https://datasheet.ciiva.com/2039/lm7805-2039365.pdf?src-supplier=Digi-Key; ComponentLink7Description: https://datasheet.ciiva.com/2039/lm7805-2039365.pdf?src-supplier=Digi-Key; ComponentLink8URL: https://datasheet.ciiva.com/48694/001253095-da-01-en-ic-reg-ldo-5v-1a-lm7805ct-to-220-3-fsc-48694790.pdf?src-supplier=Conrad; ComponentLink8Description: https://datasheet.ciiva.com/48694/001253095-da-01-en-ic-reg-ldo-5v-1a-lm7805ct-to-220-3-fsc-48694790.pdf?src-supplier=Conrad; Supplier Part Number 1: LM7805CT
XTAL1 = ATS16A-E: Crystal 16MHz ±30ppm (Tol) ±50ppm (Stability) 20pF FUND 40Ohm 2-Pin HC-49/US Thru-Hole Bulk; Manufacturer: CTS; ESR (Equivalent Series Resistance): 40R; Supplier 1: Digi-Key; Manufacturer Part Number: ATS16A-E; RoHS: Yes; Category: Crystals; Stock 1: 1809; Pricing 1: 1=0.36000, 10=0.30300, 50=0.27280, 100=0.24240, 500=0.23028, 1000=0.19392, 2500=0.18180, 5000=0.17574, 10000=0.16968 (USD); Mount: Through Hole; Contact Plating: Copper,Tin,Silver; Min Operating Temperature: -40°C; Max Operating Temperature: 85°C; Package Quantity: 100; Frequency: 16MHz; Frequency Tolerance: 30ppm; Load Capacitance: 20pF; Packaging: Bulk; Tolerance: 30ppm; Frequency Stability: 50ppm; Termination: Radial; Length: 0.427inch; Width: 0.177inch; Height: 0.145inch; Lead Free: Lead Free; ComponentLink1URL: https://datasheet.ciiva.com/4945/008-0309-0-32667-4945375.pdf?src-supplier=Mouser; ComponentLink1Description: https://datasheet.ciiva.com/4945/008-0309-0-32667-4945375.pdf?src-supplier=Mouser; ComponentLink2URL: https://datasheet.ciiva.com/861/008-0309-0-861523.pdf?src-supplier=Digi-Key; ComponentLink2Description: https://datasheet.ciiva.com/861/008-0309-0-861523.pdf?src-supplier=Digi-Key; ComponentLink3URL: https://datasheet.ciiva.com/3176/008-0309-0-3176501.pdf?src-supplier=Avnet; ComponentLink3Description: https://datasheet.ciiva.com/3176/008-0309-0-3176501.pdf?src-supplier=Avnet